# EAGLE schematic Sonar_Power_Schematic_LT1117 (EAGLE 8.4.0)
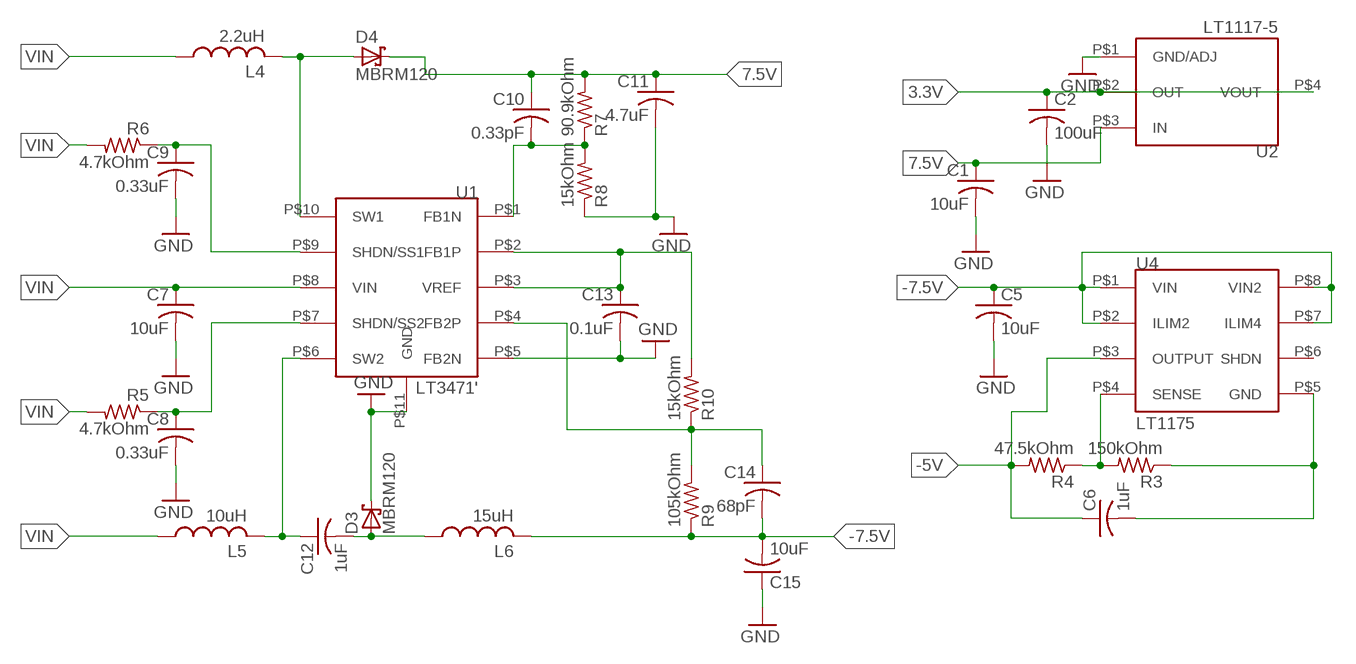
[diagram p0: schematic, sheet 1]

## Parts
C1  10uF  C-USC0603  [C0603]
C2  100uF  C-USC1210  [C1210]
C5  10uF  C-USC0603  [C0603]
C6  1uF  C-USC0603  [C0603]
C7  10uF  C-USC0603  [C0603]
C8  0.33uF  C-USC0603  [C0603]
C9  0.33uF  C-USC0603  [C0603]
C10  0.33pF  C-USC0603  [C0603]
C11  4.7uF  C-USC0603  [C0603]
C12  1uF  C-USC0603  [C0603]
C13  0.1uF  C-USC0603  [C0603]
C14  68pF  C-USC0603  [C0603]
C15  10uF  C-USC0603  [C0603]
D3  MBRM120  [DO-216AA]
D4  MBRM120  [DO-216AA]
L4  2.2uH  LQH5BPN2R2N38L  [NS4.9X4.9]
L5  10uH  VLS5045EX-100M2  [NS5X5]
L6  15uH  VLS5045EX-150M-CA1  [NS5X5]
R3  150kOhm  R-US_R0603  [R0603]
R4  47.5kOhm  R-US_R0603  [R0603]
R5  4.7kOhm  R-US_R0603  [R0603]
R6  4.7kOhm  R-US_R0603  [R0603]
R7  90.9kOhm  R-US_R0603  [R0603]
R8  15kOhm  R-US_R0603  [R0603]
R9  105kOhm  R-US_R0603  [R0603]
R10  15kOhm  R-US_R0603  [R0603]
U1  LT3471'  [10-WFDFN]
U2  LT1117-5  [SOT233-3]
U4  LT1175  [8-SOIC]

## Nets
3.3V: C2.1 U2.P$2(OUT) U2.P$4(VOUT)
7.5V: C1.1 C10.1 C11.1 D4.P$1(C) R7.2 U2.P$3(IN)
-5V: C6.1 R4.2 U4.P$3(OUTPUT)
-7.5V: C5.1 C14.2 C15.2 L6.P$2 R9.1 U4.P$1(VIN) U4.P$2(ILIM2) U4.P$7(ILIM4) U4.P$8(VIN2)
GND: C1.2 C2.2 C5.2 C7.2 C8.2 C9.2 C11.2 C13.2 C15.1 D3.P$1(C) R8.1 U1.P$5(FB2N) U1.P$11(GND) U2.P$1(GND/ADJ)
N$9: R3.2 R4.1 U4.P$4(SENSE)
N$10: C6.2 R3.1 U4.P$5(GND)
N$17: D4.P$2(A) L4.P$2 U1.P$10(SW1)
N$18: C10.2 R7.1 R8.2 U1.P$1(FB1N)
N$20: C12.1 L5.P$2 U1.P$6(SW2)
N$21: C12.2 D3.P$2(A) L6.P$1
N$26: C14.1 R9.2 R10.1 U1.P$4(FB2P)
SS1: C9.1 R6.1 U1.P$9(SHDN/SS1)
SS2: C8.1 R5.1 U1.P$7(SHDN/SS2)
VIN: C7.1 L4.P$1 L5.P$1 R5.2 R6.2 U1.P$8(VIN)
VREF: C13.1 R10.2 U1.P$2(FB1P) U1.P$3(VREF)
Unconnected: U4.P$6(SHDN)

## Library data of the parts
C1 C2 C5-C15 = adafruit:C-US: CAPACITOR, American symbol
D3 D4 = Moira:MBRM120
L4 = Moira:LQH5BPN2R2N38L: 2.2uH
L5 = Moira:VLS5045EX-100M: VLS5045EX-100M, TDK 10uH, 445-174843-1-ND
L6 = Moira:VLS5045EX-150M-CA: VLS5045EX-150M-CA, TDK 15uH, 445-175141-1-ND
R3-R10 = adafruit:R-US_: RESISTOR, American symbol
U1 = Moira:LT3471: LT3471EDD#TRPBF
U2 = Moira:LT1117-5
U4 = Moira:LT1175: LT1175IS8#PBF